# Altium project RPiZeroShield.PrjPcb
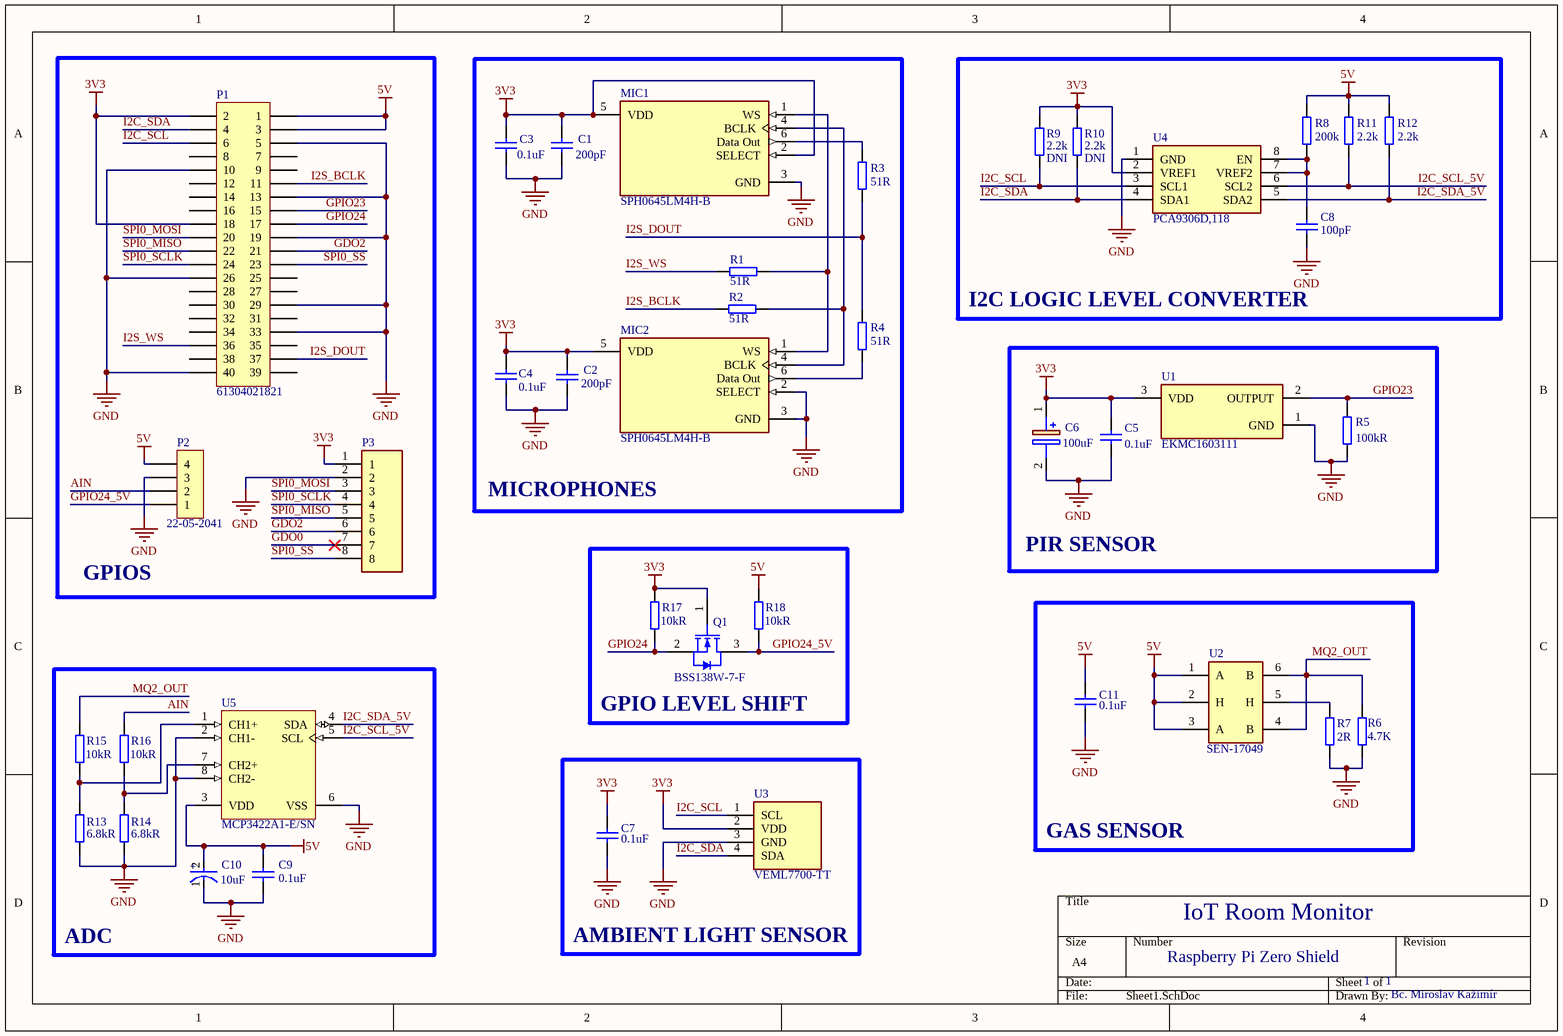
[diagram p0: Sheet1.SchDoc]
1 sheet, 40 parts. Net scope: global (net labels, ports and power ports of the same name join across sheets).
Board file: PCB1.PcbDoc

## Sheet Sheet1.SchDoc: IoT Room Monitor
size A4; DrawnBy: Bc. Miroslav Kažimír; DocumentNumber: Raspberry Pi Zero Shield; SheetNumber: 1; SheetTotal: 1

### Parts
C1  Capacitance: 200pF  [FP-C1206C-EB-MFG]  (hidden comment: C1206C201F4HACTU)
C2  Capacitance: 200pF  [FP-C1206C-EB-MFG]  (hidden comment: C1206C201F4HACTU)
C3  Capacitance: 0.1uF  [FP-GRM319-0_15-IPC_A]  (hidden comment: GRM3195C1H104GA05D)
C4  Capacitance: 0.1uF  [FP-GRM319-0_15-IPC_A]  (hidden comment: GRM3195C1H104GA05D)
C5  Capacitance: 0.1uF  [FP-GRM319-0_15-IPC_A]  (hidden comment: GRM3195C1H104GA05D)
C6  Capacitance: 100uF  [CAPPRD250W50D630H600]  (hidden comment: ECE-A0JKS101B)
C7  Capacitance: 0.1uF  [FP-GRM319-0_15-IPC_A]  (hidden comment: GRM3195C1H104GA05D)
C8  Capacitance: 100pF  [FP-C0805C-DN-IPC_A]  (hidden comment: C0805C101F3HACTU)
C9  Capacitance: 0.1uF  [FP-GRM319-0_15-IPC_A]  (hidden comment: GRM3195C1H104GA05D)
C10  Capacitance: 10uF  [FP-T491A106K020AT-MFG]  (hidden comment: T491A106K020AT)
C11  Capacitance: 0.1uF  [FP-GRM319-0_15-IPC_A]  (hidden comment: GRM3195C1H104GA05D)
MIC1  SPH0645LM4H-B  [FP-SPH0645LM4H-B-MFG]
MIC2  SPH0645LM4H-B  [FP-SPH0645LM4H-B-MFG]
P1  61304021821  [61304021821]
P2  22-05-2041  [22052041]
P3  M22-2010805  [HDRV8W60P0X200_1X8_1600X200X525P]  (value not drawn)
Q1  BSS138W-7-F  [DIOD-SOT323-3_V]
R1  Resistance: 51R  [RESC2013X70X40LL20T20]  (hidden comment: ERJ-6ENF51R0V)
R2  Resistance: 51R  [RESC2013X70X40LL20T20]  (hidden comment: ERJ-6ENF51R0V)
R3  Resistance: 51R  [RESC2013X70X40LL20T20]  (hidden comment: ERJ-6ENF51R0V)
R4  Resistance: 51R  [RESC2013X70X40LL20T20]  (hidden comment: ERJ-6ENF51R0V)
R5  Resistance: 100kR  [RESC3116X65X40LL10T20]  (hidden comment: RC1206FR-07100KL)
R6  Resistance: 4.7K  [RCC1206_e3]  (hidden comment: RCC12064K70FKEA)
R7  Resistance: 2R  [RESC3116X65N]  (hidden comment: RC1206JR-7W2RL)
R8  Resistance: 200k  [RCC1206_e3]  (hidden comment: RCC1206200KFKEA)
R9  Resistance: 2.2k  [RCC1206_e3]  (hidden comment: RCC12062K20FKEA)
R10  Resistance: 2.2k  [RCC1206_e3]  (hidden comment: RCC12062K20FKEA)
R11  Resistance: 2.2k  [RCC1206_e3]  (hidden comment: RCC12062K20FKEA)
R12  Resistance: 2.2k  [RCC1206_e3]  (hidden comment: RCC12062K20FKEA)
R13  Resistance: 6.8kR  [ERJP06_(0805)]  (hidden comment: ERJ-P06D6801V)
R14  Resistance: 6.8kR  [ERJP06_(0805)]  (hidden comment: ERJ-P06D6801V)
R15  Resistance: 10kR  [ERJP08_(1206)]  (hidden comment: ERJ-P08D1002V)
R16  Resistance: 10kR  [ERJP08_(1206)]  (hidden comment: ERJ-P08D1002V)
R17  Resistance: 10kR  [ERJP08_(1206)]  (hidden comment: ERJ-P08D1002V)
R18  Resistance: 10kR  [ERJP08_(1206)]  (hidden comment: ERJ-P08D1002V)
U1  EKMC1603111  [FP-EKMC1603111-MFG]
U2  SEN-17049  [SEN17049]
U3  VEML7700-TT  [VEML7700]
U4  PCA9306D,118  [SOIC127P600X175-8N]
U5  MCP3422A1-E/SN  [SOIC-SN8_N]

### Blocks framed on the sheet
GPIOS: P1-P3
MICROPHONES: C1-C4 MIC1 MIC2 R1-R4
I2C LOGIC LEVEL CONVERTER: C8 R8-R12 U4
PIR SENSOR: C5 C6 R5 U1
GPIO LEVEL SHIFT: Q1 R17 R18
GAS SENSOR: C11 R6 R7 U2
ADC: C9 C10 R13-R16 U5
AMBIENT LIGHT SENSOR: C7 U3

### Nets
3V3: C1.1 C2.1 C3.2 C4.2 C5.2 C6.1(+) C7.1 MIC1.2(SELECT) MIC1.5(VDD) MIC2.5(VDD) P1.2 P1.18 P3.1 Q1.1(G) R9.1 R10.1 R17.1 U1.3(VDD) U3.2(VDD) U4.2(VREF1)
5V: C9.1 C10.2(A) C11.1 P1.1 P1.3 P2.4 R8.2 R11.1 R12.1 R18.1 U2.1(A) U2.2(H) U2.3(A) U5.3(VDD)
GND: C1.2 C2.2 C3.1 C4.1 C5.1 C6.2(-) C7.2 C8.2 C9.2 C10.1(C) C11.2 MIC1.3(GND) MIC2.2(SELECT) MIC2.3(GND) P1.5 P1.10 P1.13 P1.19 P1.26 P1.29 P1.33 P1.40 P2.3 P3.2 R5.2 R6.1 R7.2 R13.2 R14.2 U1.1(GND) U3.3(GND) U4.1(GND) U5.2(CH1-) U5.6(VSS) U5.8(CH2-)
AIN: P2.2 R16.1
GDO0: P3.7
GDO2: P1.21 P3.6
GPIO23: P1.15 R5.1 U1.2(OUTPUT)
GPIO24: P1.17 Q1.2(S) R17.2
GPIO24_5V: P2.1 Q1.3(D) R18.2
I2C_SCL: P1.6 R9.2 U3.1(SCL) U4.3(SCL1)
I2C_SCL_5V: R11.2 U4.6(SCL2) U5.5(SCL)
I2C_SDA: P1.4 R10.2 U3.4(SDA) U4.4(SDA1)
I2C_SDA_5V: R12.2 U4.5(SDA2) U5.4(SDA)
I2S_BCLK: P1.11 R2.1
I2S_DOUT: P1.37 R3.2 R4.2
I2S_WS: P1.36 R1.1
MQ2_OUT: R6.2 R15.1 U2.4(B) U2.6(B)
SPI0_MISO: P1.22 P3.5
SPI0_MOSI: P1.20 P3.3
SPI0_SCLK: P1.24 P3.4
SPI0_SS: P1.23 P3.8
NetC8_1: C8.1 R8.1 U4.7(VREF2) U4.8(EN)
NetMIC1_1: MIC1.1(WS) MIC2.1(WS) R1.2
NetMIC1_4: MIC1.4(BCLK) MIC2.4(BCLK) R2.2
NetMIC1_6: MIC1.6(Data_Out) R3.1
NetMIC2_6: MIC2.6(Data_Out) R4.1
NetR7_1: R7.1 U2.5(H)
NetR13_1: R13.1 R15.2 U5.1(CH1+)
NetR14_1: R14.1 R16.2 U5.7(CH2+)

Not connected (* = marked no-connect by the designer): P1 7 8 9 12 14 16 25 27 28 30 31 32 34 35 38 39

### Notes on the sheet
- DNI
- (near R10) DNI
- (in symbol T491A106K020AT) +

### Library data of the parts
C1 C2 = C1206C201F4HACTU: Manufacturer: KEMET; Supplier 1: Mouser; Manufacturer Part Number: C1206C201F4HACTU; RoHS: Yes; Category: Ceramic Capacitors; Stock 1: 3719; Pricing 1: 1=0,41000, 10=0,27900, 50=0,27900, 100=0,16700, 1000=0,11500, 10000=0,09500 (USD); RoHS Compliant: Yes; Supplier Part Number 1: 80-C1206C201F4HACTU
C3-C5 C7 C9 C11 = GRM3195C1H104GA05D: Multi-Layer Ceramic Capacitor 0.1uF C0G 2% 1206 Paper T/R; Manufacturer: Murata; Supplier 1: Mouser; Manufacturer Part Number: GRM3195C1H104GA05D; RoHS: Yes; Category: Ceramic Capacitors; Stock 1: 17820; Pricing 1: 1=0,69000, 10=0,51100, 50=0,51100, 100=0,35000, 500=0,27800, 1000=0,25100, 2000=0,21300, 10000=0,21300 (USD); RoHS Compliant: Yes; Supplier Part Number 1: 81-GRM3195C1H104GA5D
C6 = ECE-A0JKS101B: Cap Aluminum 100uF 6.3V 20% (6.3 X 5mm) Radial 5mm 71mA 1000 hr 85°C Ammo Pack; Manufacturer: Panasonic; Life (Hours): 1000Hour; Lead Diameter: 0.45mm; Supplier 1: Mouser; Manufacturer Part Number: ECE-A0JKS101B; RoHS: Yes; Category: Aluminum Electrolytic Capacitors; Stock 1: 2081; Pricing 1: 1=0,36000, 10=0,24500, 50=0,16400, 100=0,14000, 1000=0,09900, 10000=0,07500 (USD); Mount: Through Hole; Case/Package: Radial; Contact Plating: Tin; Min Operating Temperature: -40°C; Max Operating Temperature: 85°C; Tolerance: 20%; Ripple Current: 71mA; Termination: Radial; Packaging: Tape and Reel; Package Quantity: 2000; Voltage Rating (DC): 6.3V; Voltage Rating: 6.3V; Series: KS; Construction: RADIAL; Diameter: 6.3mm; Length: 5mm; Height: 5mm; Lead Pitch: 5mm; Height - Seated (Max): 0.236inch; Radiation Hardening: No; RoHS Compliant: Yes; ComponentLink1URL: https://datasheet.ciiva.com/24066/a-e-461514-24066346.pdf?src-supplier=Mouser; ComponentLink1Description: https://datasheet.ciiva.com/24066/a-e-461514-24066346.pdf?src-supplier=Mouser; ComponentLink2URL: https://datasheet.ciiva.com/11680/aba0000ce15-11680725.pdf?src-supplier=Avnet; ComponentLink2Description: https://datasheet.ciiva.com/11680/aba0000ce15-11680725.pdf?src-supplier=Avnet; ComponentLink3URL: https://datasheet.ciiva.com/17536/aba0000ce15-17536026.pdf?src-supplier=Avnet+Europe; ComponentLink3Description: https://datasheet.ciiva.com/17536/aba0000ce15-17536026.pdf?src-supplier=Avnet+Europe; Supplier Part Number 1: 667-ECE-A0JKS101B
C8 = C0805C101F3HACTU: 100.pf 25.0V Rohs Compliant: Yes; Manufacturer: KEMET; Supplier 1: Mouser; Manufacturer Part Number: C0805C101F3HACTU; RoHS: Yes; Category: Ceramic Capacitors; Stock 1: 6773; Pricing 1: 1=0,30000, 10=0,20400, 50=0,20400, 100=0,10400, 1000=0,06200, 10000=0,05400 (USD); RoHS Compliant: Yes; Supplier Part Number 1: 80-C0805C101F3HACTU
C10 = T491A106K020AT: Cap Tant Solid 10uF 20V A CASE 10% (3.2 X 1.6 X 1.6mm) Inward L SMD 3216-18 5 Ohm 125°C T/R; Manufacturer: KEMET; Supplier 1: Mouser; Manufacturer Part Number: T491A106K020AT; RoHS: Yes; Category: Tantalum Capacitors; Stock 1: 134225; Pricing 1: 1=0,70000, 10=0,49300, 50=0,37300, 100=0,32500, 1000=0,31800, 10000=0,19100 (USD); Case/Package: 3216-18; Tolerance: 10%; Length: 3.2mm; Width: 1.6mm; Height: 1.6mm; Lead Free: Lead Free; RoHS Compliant: Yes; ComponentLink1URL: https://4donline.ihs.com/images/VipMasterIC/IC/KEME/KEME-S-A0006487387/KEME-S-A0006487387-1.pdf?hkey=52A5661711E402568146F3353EA87419&src-supplier=Element14; ComponentLink1Description: https://4donline.ihs.com/images/VipMasterIC/IC/KEME/KEME-S-A0006487387/KEME-S-A0006487387-1.pdf?hkey=52A5661711E402568146F3353EA87419&src-supplier=Element14; ComponentLink2URL: https://4donline.ihs.com/images/VipMasterIC/IC/KEME/KEME-S-A0006487387/KEME-S-A0006487387-1.pdf?hkey=52A5661711E402568146F3353EA87419&src-supplier=Farnell; ComponentLink2Description: https://4donline.ihs.com/images/VipMasterIC/IC/KEME/KEME-S-A0006487387/KEME-S-A0006487387-1.pdf?hkey=52A5661711E402568146F3353EA87419&src-supplier=Farnell; ComponentLink3URL: https://4donline.ihs.com/images/VipMasterIC/IC/KEME/KEME-S-A0006487387/KEME-S-A0006487387-1.pdf?hkey=52A5661711E402568146F3353EA87419&src-supplier=Newark; ComponentLink3Description: https://4donline.ihs.com/images/VipMasterIC/IC/KEME/KEME-S-A0006487387/KEME-S-A0006487387-1.pdf?hkey=52A5661711E402568146F3353EA87419&src-supplier=Newark; ComponentLink4URL: https://api.kemet.com/component-edge/download/datasheet/T491A106K020AT.pdf?src-supplier=Digi-Key; ComponentLink4Description: https://api.kemet.com/component-edge/download/datasheet/T491A106K020AT.pdf?src-supplier=Digi-Key; Supplier Part Number 1: 80-T491A106K020AT
MIC1 MIC2 = SPH0645LM4H-B: Crawford Mic Dgt I2S Bottom Port; Manufacturer: Knowles; Shape: Rectangular; Direction: Omnidirectional; Voltage Rating: 1.8V; Operating Supply Current: 600uA; Output Type: Digital; Supplier 1: Mouser; Manufacturer Part Number: SPH0645LM4H-B; RoHS: Yes; Category: Microphones; Stock 1: 19165; Pricing 1: 1=2,91000, 10=2,42000, 25=2,23000, 50=2,10000, 100=1,97000, 500=1,71000, 1000=1,67000, 10000=1,67000 (USD); Packaging: Tape and Reel; Termination: Solder; Length: 3.5mm; Width: 2.65mm; Height: 1.08mm; RoHS Compliant: Yes; ComponentLink1URL: https://media.digikey.com/pdf/Data%20Sheets/Knowles%20Acoustics%20PDFs/SPH0645LM4H-B.pdf?src-supplier=Digi-Key; ComponentLink1Description: https://media.digikey.com/pdf/Data%20Sheets/Knowles%20Acoustics%20PDFs/SPH0645LM4H-B.pdf?src-supplier=Digi-Key; Supplier Part Number 1: 721-SPH0645LM4H-B
P1 = 61304021821: THT Vertical Socket Header WR-PHD, Pitch 2.54 mm, Dual Row, 40 pins; Manufacturer: Wurth Electronics; Gender: Female; Supplier 1: Mouser; Manufacturer Part Number: 61304021821; RoHS: Yes; Stock 1: 6022; Pricing 1: 1=1,92000, 10=1,76000, 50=1,57000, 100=1,37000, 1000=1,27000, 10000=1,27000 (USD); Contact Material: Copper Alloy; RoHS Compliant: Yes; Supplier Part Number 1: 710-61304021821
P2 = 22-05-2041: Connector Unshrouded Header 4 Position 2.54mm Solder Right Angle Thru-Hole Bulk; Manufacturer: Molex; Supplier 1: Mouser; Manufacturer Part Number: 22-05-2041; RoHS: Yes; Category: Headers and Wire Housings; Stock 1: 215; Pricing 1: 1=0,31000, 10=0,27800, 50=0,27800, 100=0,20300, 1000=0,18600, 10000=0,15600 (USD); ComponentLink1URL: https://datasheet.ciiva.com/3934/344080022052041-pcb-headers-3934066.pdf?src-supplier=Arrow+Electronics; ComponentLink1Description: https://datasheet.ciiva.com/3934/344080022052041-pcb-headers-3934066.pdf?src-supplier=Arrow+Electronics; ComponentLink2URL: https://datasheet.ciiva.com/1479/022052031-sd-1479057.pdf?src-supplier=Newark; ComponentLink2Description: https://datasheet.ciiva.com/1479/022052031-sd-1479057.pdf?src-supplier=Newark; ComponentLink3URL: https://datasheet.ciiva.com/11747/0900766b80027334-11747944.pdf?src-supplier=RSComponents; ComponentLink3Description: https://datasheet.ciiva.com/11747/0900766b80027334-11747944.pdf?src-supplier=RSComponents; ComponentLink4URL: https://datasheet.ciiva.com/30116/37900022052041-pcb-headers-30116714.pdf?src-supplier=Onlinecomponents.com; ComponentLink4Description: https://datasheet.ciiva.com/30116/37900022052041-pcb-headers-30116714.pdf?src-supplier=Onlinecomponents.com; ComponentLink5URL: https://datasheet.ciiva.com/19462/878673-19462259.pdf?src-supplier=Jameco; ComponentLink5Description: https://datasheet.ciiva.com/19462/878673-19462259.pdf?src-supplier=Jameco; ComponentLink6URL: https://datasheet.ciiva.com/5155/0022052041-pcb-headers-158320-5155332.pdf?src-supplier=Mouser; ComponentLink6Description: https://datasheet.ciiva.com/5155/0022052041-pcb-headers-158320-5155332.pdf?src-supplier=Mouser; ComponentLink7URL: https://datasheet.ciiva.com/7843/7386-7843894.pdf?src-supplier=Element14; ComponentLink7Description: https://datasheet.ciiva.com/7843/7386-7843894.pdf?src-supplier=Element14; ComponentLink8URL: https://datasheet.ciiva.com/1433/1848135-1433606.pdf?src-supplier=Element14; ComponentLink8Description: https://datasheet.ciiva.com/1433/1848135-1433606.pdf?src-supplier=Element14; ComponentLink9URL: https://datasheet.ciiva.com/10088/0022052041-pcb-headers-10088858.pdf?src-supplier=Avnet; ComponentLink9Description: https://datasheet.ciiva.com/10088/0022052041-pcb-headers-10088858.pdf?src-supplier=Avnet; Supplier Part Number 1: 538-22-05-2041
P3 = M22-2010805: Connector, Header, 8Pos, 1Row, 2Mm Rohs Compliant: Yes; Manufacturer: Harwin; Number of Contacts: 8; Max Current Rating: 1A; Contact Resistance: 20mR; Voltage Rating: 650V; Insulation Resistance: 10GR; Connector Type: Male Pin; Supplier 1: Mouser; Manufacturer Part Number: M22-2010805; RoHS: Yes; Category: Headers and Wire Housings; Stock 1: 686; Pricing 1: 1=0,57000, 10=0,44500, 50=0,44500, 100=0,38500, 1000=0,28800, 10000=0,23600 (USD); Mount: Through Hole; Case/Package: SIL; Contact Plating: Gold; Contact Material: Bronze; Color: Black; Housing Color: Black; Housing Material: Nylon; Min Operating Temperature: -55°C; Max Operating Temperature: 105°C; Number of Rows: 1; Termination: Solder; Current Rating: 1A; Package Quantity: 1000; Packaging: Bulk; Number of Positions: 8; Orientation: Straight; Series: M22; Contact Type: Male Pin; Length: 16mm; Pitch: 2mm; Contact Mating Length: 0.138inch; Depth: 2mm; Radiation Hardening: No; REACH SVHC: No SVHC; Flammability Rating: UL94 V-0; RoHS Compliant: Yes; ComponentLink1URL: https://datasheet.ciiva.com/11751/0900766b800345c0-11751285.pdf?src-supplier=RSComponents; ComponentLink1Description: https://datasheet.ciiva.com/11751/0900766b800345c0-11751285.pdf?src-supplier=RSComponents; ComponentLink2URL: https://datasheet.ciiva.com/9479/m22-201-9479493.pdf?src-supplier=Avnet; ComponentLink2Description: https://datasheet.ciiva.com/9479/m22-201-9479493.pdf?src-supplier=Avnet; ComponentLink3URL: https://datasheet.ciiva.com/6814/m22-201-6814953.pdf?src-supplier=Digi-Key; ComponentLink3Description: https://datasheet.ciiva.com/6814/m22-201-6814953.pdf?src-supplier=Digi-Key; Supplier Part Number 1: 855-M22-2010805
Q1 = BSS138W-7-F: N沟道 VDS=50V VGS=±20V ID=200mA P=200mW; Manufacturer: Diodes; Continuous Drain Current (ID): 200mA; Nominal Vgs: 1.2V; Max Power Dissipation: 200mW; Drain to Source Voltage (Vdss): 50V; Gate to Source Voltage (Vgs): 20V; Rds On Max: 3.5R; Input Capacitance: 50pF; Number of Elements: 1; Drain to Source Breakdown Voltage: 75V; Drain to Source Resistance: 1.4R; Turn-Off Delay Time: 20ns; Element Configuration: Single; Polarity: N-CHANNEL; Supplier 1: Mouser; Manufacturer Part Number: BSS138W-7-F; RoHS: Yes; Category: MOSFETs; Stock 1: 140567; Pricing 1: 1=0,32000, 10=0,26800, 50=0,26800, 100=0,14300, 500=0,09400, 1000=0,06400, 3000=0,04900, 9000=0,04200, 10000=0,04200, 24000=0,03900, 45000=0,03500 (USD); Mount: Surface Mount; Case/Package: SOT-323; Number of Pins: 3; Weight: 0.000212oz; Contact Plating: Tin,Matte; Min Operating Temperature: -55°C; Max Operating Temperature: 150°C; Threshold Voltage: 1.2V; Packaging: Tape and Reel; Package Quantity: 3000; Dual Supply Voltage: 50V; Power Dissipation: 200mW; Turn-On Delay Time: 20ns; Termination: SMD/SMT; Number of Channels: 1; Voltage Rating (DC): 50V; Current Rating: 200mA; Voltage: 50V; On-State Resistance: 3.5R; Series: -; Drain-source On Resistance-Max: 3.5R; Length: 2.2mm; Width: 1.35mm; Height: 1mm; REACH SVHC: No SVHC; Lead Free: Lead Free; RoHS Compliant: Yes; ComponentLink1URL: https://datasheet.ciiva.com/19479/1589937-19479882.pdf?src-supplier=Jameco; ComponentLink1Description: https://datasheet.ciiva.com/19479/1589937-19479882.pdf?src-supplier=Jameco; ComponentLink2URL: https://datasheet.ciiva.com/4442/ds30206-79208-4442805.pdf?src-supplier=Mouser; ComponentLink2Description: https://datasheet.ciiva.com/4442/ds30206-79208-4442805.pdf?src-supplier=Mouser; ComponentLink3URL: https://datasheet.ciiva.com/8115/ds30206-8115376.pdf?src-supplier=Avnet; ComponentLink3Description: https://datasheet.ciiva.com/8115/ds30206-8115376.pdf?src-supplier=Avnet; ComponentLink4URL: https://datasheet.ciiva.com/17099/bss138w-7-f-17099411.pdf?src-supplier=Allied+Electronics; ComponentLink4Description: https://datasheet.ciiva.com/17099/bss138w-7-f-17099411.pdf?src-supplier=Allied+Electronics; ComponentLink5URL: https://datasheet.ciiva.com/1190/ds30206-1190191.pdf?src-supplier=Element14; ComponentLink5Description: https://datasheet.ciiva.com/1190/ds30206-1190191.pdf?src-supplier=Element14; ComponentLink6URL: https://datasheet.ciiva.com/8115/ds30206-8115303.pdf?src-supplier=Avnet; ComponentLink6Description: https://datasheet.ciiva.com/8115/ds30206-8115303.pdf?src-supplier=Avnet; ComponentLink7URL: https://datasheet.ciiva.com/941/ds30206-941177.pdf?src-supplier=Digi-Key; ComponentLink7Description: https://datasheet.ciiva.com/941/ds30206-941177.pdf?src-supplier=Digi-Key; ComponentLink8URL: https://datasheet.ciiva.com/6383/ds30206-6383772.pdf?src-supplier=Digi-Key; ComponentLink8Description: https://datasheet.ciiva.com/6383/ds30206-6383772.pdf?src-supplier=Digi-Key; Supplier Part Number 1: 621-BSS138W-F
R1-R4 = ERJ-6ENF51R0V: 贴片电阻 51Ω ±1% 1/8W ±100ppm/℃ 0805; Manufacturer: Panasonic; Temperature Coefficient: 100ppm/°C; Voltage Rating: 150V; Power Rating: 125mW; Supplier 1: Mouser; Manufacturer Part Number: ERJ-6ENF51R0V; RoHS: Yes; Category: Chip SMD Resistors; Stock 1: 33426; Pricing 1: 1=0,11000, 10=0,08300, 50=0,08300, 100=0,03200, 1000=0,01400, 2500=0,01300, 5000=0,01000, 10000=0,01000 (USD); Mount: Surface Mount; Case/Package: 0805; Contact Plating: Tin; Case Code (Metric): 2012; Case Code (Imperial): 0805; Min Operating Temperature: -55°C; Max Operating Temperature: 155°C; Tolerance: 1%; Resistor Type: Thick Film; Packaging: Tape and Reel; Package Quantity: 1; Number of Terminations: 2; Termination: SMD/SMT; Max Power Dissipation: 125mW; Voltage Rating (DC): 150V; Features: Automotive AEC-Q200; Series: ERJ; Technology: THICK FILM; Construction: Rectangular; Resistance Tolerance: 1%; Length: 2mm; Width: 0.049inch; Height: 0.6mm; Depth: 1.25mm; Radiation Hardening: No; REACH SVHC: No SVHC; Military Standard: Not; RoHS Compliant: Yes; ComponentLink1URL: https://datasheet.ciiva.com/11821/0900766b80f80784-11821666.pdf?src-supplier=RSComponents; ComponentLink1Description: https://datasheet.ciiva.com/11821/0900766b80f80784-11821666.pdf?src-supplier=RSComponents; ComponentLink2URL: https://datasheet.ciiva.com/46444/1678782-46444822.pdf?src-supplier=Element14; ComponentLink2Description: https://datasheet.ciiva.com/46444/1678782-46444822.pdf?src-supplier=Element14; ComponentLink3URL: https://datasheet.ciiva.com/24069/aoa0000ce2-24069916.pdf?src-supplier=Mouser; ComponentLink3Description: https://datasheet.ciiva.com/24069/aoa0000ce2-24069916.pdf?src-supplier=Mouser; ComponentLink4URL: https://datasheet.ciiva.com/16787/70260748-16787022.pdf?src-supplier=Allied+Electronics; ComponentLink4Description: https://datasheet.ciiva.com/16787/70260748-16787022.pdf?src-supplier=Allied+Electronics; ComponentLink5URL: https://datasheet.ciiva.com/16786/70260748-16786149.pdf?src-supplier=Allied+Electronics; ComponentLink5Description: https://datasheet.ciiva.com/16786/70260748-16786149.pdf?src-supplier=Allied+Electronics; ComponentLink6URL: https://datasheet.ciiva.com/9189/aoa0000ce2-9189048.pdf?src-supplier=Avnet; ComponentLink6Description: https://datasheet.ciiva.com/9189/aoa0000ce2-9189048.pdf?src-supplier=Avnet; ComponentLink7URL: https://datasheet.ciiva.com/30237/aoa0000ce2-30237990.pdf?src-supplier=Onlinecomponents.com; ComponentLink7Description: https://datasheet.ciiva.com/30237/aoa0000ce2-30237990.pdf?src-supplier=Onlinecomponents.com; ComponentLink8URL: https://datasheet.ciiva.com/17209/aoa0000ce2-17209369.pdf?src-supplier=Avnet+Europe; ComponentLink8Description: https://datasheet.ciiva.com/17209/aoa0000ce2-17209369.pdf?src-supplier=Avnet+Europe; Supplier Part Number 1: 667-ERJ-6ENF51R0V
R5 = RC1206FR-07100KL: 贴片电阻 100000Ω ± 1.00% 0.25W ± 100ppm/℃ 1206; Manufacturer: Yageo; Tolerance: 1%; Temperature Coefficient: 100ppm/°C; Power Rating: 250mW; Voltage Rating: 200V; Supplier 1: Mouser; Manufacturer Part Number: RC1206FR-07100KL; RoHS: Yes; Category: Chip SMD Resistors; Stock 1: 216861; Pricing 1: 1=0,10000, 10=0,05200, 50=0,05200, 100=0,02200, 1000=0,01000, 10000=0,00500 (USD); Case/Package: 1206; Case Code (Imperial): 1206; Case Code (Metric): 3216; Size Code: 1206; Min Operating Temperature: -55°C; Max Operating Temperature: 155°C; Packaging: Tape and Reel; Resistor Type: Thick Film; Termination: SMD/SMT; Features: Moisture Resistant; Series: RC; Max Power Dissipation: 250mW; Number of Terminations: 2; Resistance Tolerance: 1%; Length: 3.1mm; Height: 0.55mm; Depth: 1.6mm; REACH SVHC: No SVHC; Lead Free: Lead Free; RoHS Compliant: Yes; Supplier Part Number 1: 603-RC1206FR-07100KL
R6 = RCC12064K70FKEA: Res, 4K7, 1%, 0.5W, 1206, Thick Film;; Manufacturer: Vishay; Supplier 1: Mouser; Manufacturer Part Number: RCC12064K70FKEA; RoHS: Yes; Category: Chip SMD Resistors; Stock 1: 24548; Pricing 1: 1=0,32000, 10=0,27600, 50=0,27600, 100=0,10800, 250=0,10700, 1000=0,04500, 5000=0,04300, 10000=0,04300 (USD); Supplier Part Number 1: 71-RCC12064K70FKEA
R7 = RC1206JR-7W2RL: Res Thick Film 1206 2 Ohm 5% 0.5W(1/2W) ±200ppm/C Pad SMD T/R; Manufacturer: Yageo; Supplier 1: Mouser; Manufacturer Part Number: RC1206JR-7W2RL; RoHS: Yes; Category: Resistors; Stock 1: 5881; Pricing 1: 1=0,19000, 10=0,15900, 50=0,15900, 100=0,06300, 1000=0,03100, 10000=0,02000 (USD); Case/Package: 1206; Tolerance: 5%; RoHS Compliant: Yes; Supplier Part Number 1: 603-RC1206JR-7W2RL
R8 = RCC1206200KFKEA: Res, AEC-Q200, 200K, 1%, 0.5W, 1206 Rohs Compliant: Yes; Manufacturer: Vishay; Supplier 1: Mouser; Manufacturer Part Number: RCC1206200KFKEA; RoHS: Yes; Category: Chip SMD Resistors; Stock 1: 7464; Pricing 1: 1=0,32000, 10=0,27600, 50=0,27600, 100=0,10800, 250=0,10700, 1000=0,04500, 5000=0,04300, 10000=0,04300 (USD); Supplier Part Number 1: 71-RCC1206200KFKEA
R9-R12 = RCC12062K20FKEA: Res, Aec-Q200, 2K2, 1%, 0.5W, 1206 Rohs Compliant: Yes; Manufacturer: Vishay; Supplier 1: Mouser; Manufacturer Part Number: RCC12062K20FKEA; RoHS: No; Category: Chip SMD Resistors; Stock 1: 10157; Pricing 1: 1=0,32000, 10=0,27600, 50=0,27600, 100=0,10800, 250=0,10700, 1000=0,04500, 5000=0,04300, 10000=0,04300 (USD); Supplier Part Number 1: 71-RCC12062K20FKEA
R13 R14 = ERJ-P06D6801V: Res Thick Film 0805 6.8K Ohm 0.5% 0.25W ±100ppm/°C Molded SMD Punched Carrier T/R; Manufacturer: Panasonic; Power Rating: 500mW; Voltage Rating: 400V; Supplier 1: Mouser; Manufacturer Part Number: ERJ-P06D6801V; RoHS: Yes; Category: Chip SMD Resistors; Stock 1: 8417; Pricing 1: 1=0,31000, 10=0,27300, 50=0,27300, 100=0,10700, 1000=0,04500, 10000=0,03500 (USD); Mount: Surface Mount; Case/Package: 0805; Weight: 0.000194oz; Case Code (Imperial): 0805; Case Code (Metric): 2012; Min Operating Temperature: -55°C; Max Operating Temperature: 155°C; Tolerance: 0.5%; Packaging: Tape and Reel; Package Quantity: 5000; Resistor Type: Thick Film; Termination: SMD/SMT; Temperature Coefficient: 100ppm/°C; Length: 2mm; Width: 1.2mm; Height: 0.6mm; ComponentLink1URL: https://datasheet.ciiva.com/24180/aoa0000ce4-64075-24180870.pdf?src-supplier=Mouser; ComponentLink1Description: https://datasheet.ciiva.com/24180/aoa0000ce4-64075-24180870.pdf?src-supplier=Mouser; Supplier Part Number 1: 667-ERJ-P06D6801V
R15-R18 = ERJ-P08D1002V: Res Thick Film 1206 10K Ohm 0.5% 0.33W ±100ppm/°C Molded SMD Punched Carrier T/R; Manufacturer: Panasonic; Power Rating: 660mW; Voltage Rating: 500V; Supplier 1: Mouser; Manufacturer Part Number: ERJ-P08D1002V; RoHS: Yes; Category: Chip SMD Resistors; Stock 1: 4279; Pricing 1: 1=0,36000, 10=0,31400, 50=0,31400, 100=0,12600, 1000=0,06000, 10000=0,04000 (USD); Mount: Surface Mount; Case/Package: 1206; Case Code (Imperial): 1206; Case Code (Metric): 3216; Min Operating Temperature: -55°C; Max Operating Temperature: 155°C; Package Quantity: 5000; Packaging: Tape and Reel; Tolerance: 0.5%; Resistor Type: Thick Film; Temperature Coefficient: 100ppm/°C; Length: 3.2mm; Width: 1.6mm; Height: 0.6mm; ComponentLink1URL: http://www.mouser.com/ds/2/315/AOA0000C291-1101061.pdf?src-supplier=Mouser; ComponentLink1Description: http://www.mouser.com/ds/2/315/AOA0000C291-1101061.pdf?src-supplier=Mouser; ComponentLink2URL: http://www.onlinecomponents.com/datasheet/erj-p08d1002v.aspx?p=44449323&src-supplier=Onlinecomponents.com; ComponentLink2Description: http://www.onlinecomponents.com/datasheet/erj-p08d1002v.aspx?p=44449323&src-supplier=Onlinecomponents.com; Supplier Part Number 1: 667-ERJ-P08D1002V
U1 = EKMC1603111: PaPIRs MOTION SENSOR VZ series 170uA (White) 12m detection range; Manufacturer: Panasonic; Max Supply Voltage: 6V; Min Supply Voltage: 3V; Sensing Distance: 472inch; Output Type: Digital; Sensing Method: Infrared (IR); Output Voltage: 500mV; Supplier 1: Mouser; Manufacturer Part Number: EKMC1603111; RoHS: Yes; Category: Motion Sensors; Stock 1: 270; Pricing 1: 1=13,18000, 10=10,76000, 50=9,95000, 100=8,33000, 250=8,06000, 500=7,80000, 1000=7,39000, 2500=7,15000, 5000=6,99000, 10000=7,39000 (USD); Mount: Through Hole; Case/Package: TO-5; Number of Pins: 3; Min Operating Temperature: -20°C; Max Operating Temperature: 60°C; Packaging: Bulk; Package Quantity: 50; Operating Supply Current: 170uA; Min Supply Voltage (DC): 3V; Max Supply Voltage (DC): 6V; Output Current: 170uA; REACH SVHC: No SVHC; Lead Free: Lead Free; RoHS Compliant: Yes; ComponentLink1URL: https://datasheet.ciiva.com/1314/1537854-1314623.pdf?src-supplier=Element14; ComponentLink1Description: https://datasheet.ciiva.com/1314/1537854-1314623.pdf?src-supplier=Element14; ComponentLink2URL: https://datasheet.ciiva.com/1314/1537854-1314441.pdf?src-supplier=Element14; ComponentLink2Description: https://datasheet.ciiva.com/1314/1537854-1314441.pdf?src-supplier=Element14; ComponentLink3URL: https://datasheet.ciiva.com/24392/papirs-ekmc-catalog-24392999.pdf?src-supplier=Onlinecomponents.com; ComponentLink3Description: https://datasheet.ciiva.com/24392/papirs-ekmc-catalog-24392999.pdf?src-supplier=Onlinecomponents.com; Supplier Part Number 1: 769-EKMC1603111
U2 = SEN-17049: Smoke Sensor - MQ-2; Manufacturer: SparkFun; Supplier 1: Mouser; Manufacturer Part Number: SEN-17049; RoHS: No; Stock 1: 63; Pricing 1: 1=4,95000, 10=4,95000, 50=4,95000, 100=4,95000, 1000=4,95000, 10000=4,95000 (USD); Supplier Part Number 1: 474-SEN-17049
U3 = VEML7700-TT: Light to Digital Ambient Light Sensor Digital 0lux to 167000lux 8-Pin SMD T/R; Manufacturer: Vishay Semiconductors; Min Supply Voltage (DC): 2.5V; Max Supply Voltage (DC): 3.6V; Output Current: 3mA; Supplier 1: Mouser; Manufacturer Part Number: VEML7700-TT; RoHS: Yes; Category: Connectors; Stock 1: 23053; Pricing 1: 1=2,13000, 10=1,50000, 50=1,50000, 100=1,16000, 1000=0,86300, 10000=0,86200 (USD); Mount: Surface Mount; Case/Package: SMD/SMT; Packaging: Tape and Reel; REACH SVHC: No SVHC; RoHS Compliant: Yes; ComponentLink1URL: http://www.farnell.com/datasheets/2118175.pdf?_ga=2.74067602.1265931949.1503988629-1413671594.1503025027&src-supplier=Farnell; ComponentLink1Description: http://www.farnell.com/datasheets/2118175.pdf?_ga=2.74067602.1265931949.1503988629-1413671594.1503025027&src-supplier=Farnell; ComponentLink2URL: http://www.farnell.com/datasheets/2118175.pdf?src-supplier=Element14; ComponentLink2Description: http://www.farnell.com/datasheets/2118175.pdf?src-supplier=Element14; ComponentLink3URL: http://www.farnell.com/datasheets/2118175.pdf?_ga=2.74067602.1265931949.1503988629-1413671594.1503025027&src-supplier=Newark; ComponentLink3Description: http://www.farnell.com/datasheets/2118175.pdf?_ga=2.74067602.1265931949.1503988629-1413671594.1503025027&src-supplier=Newark; ComponentLink4URL: http://www.vishay.com/docs/84286/veml7700.pdf?src-supplier=Digi-Key; ComponentLink4Description: http://www.vishay.com/docs/84286/veml7700.pdf?src-supplier=Digi-Key; Supplier Part Number 1: 78-VEML7700-TT
U4 = PCA9306D,118: PCA9306 Series 3.3 V Dual Bidirectional Voltage-Level Translator - SOIC-8; Manufacturer: NXP Semiconductors; Interface: I2C,SMBus; Min Supply Voltage: 1V; Max Supply Voltage: 5V; Number of Channels: 2; Propagation Delay: 3.3ns; Turn-On Delay Time: 1.5ns; Supplier 1: Mouser; Manufacturer Part Number: PCA9306D,118; RoHS: Yes; Category: Interface ICs; Stock 1: 2085; Pricing 1: 1=0,96000, 10=0,84000, 50=0,84000, 100=0,64400, 250=0,59800, 500=0,50900, 1000=0,48000, 2500=0,47900, 10000=0,47900 (USD); Mount: Surface Mount; Case/Package: SO; Number of Pins: 8; Min Operating Temperature: -40°C; Max Operating Temperature: 85°C; Logic Function: Translator; Package Quantity: 2500; Packaging: Tape and Reel; Number of Bits: 2; Output Type: Voltage; Series: -; Radiation Hardening: No; REACH SVHC: No SVHC; Lead Free: Lead Free; RoHS Compliant: Yes; ComponentLink1URL: https://datasheet.ciiva.com/1898/pca9306-1898992.pdf?src-supplier=Digi-Key; ComponentLink1Description: https://datasheet.ciiva.com/1898/pca9306-1898992.pdf?src-supplier=Digi-Key; ComponentLink2URL: https://datasheet.ciiva.com/15095/getdatasheetpartid-468969-15095628.pdf?src-supplier=Verical; ComponentLink2Description: https://datasheet.ciiva.com/15095/getdatasheetpartid-468969-15095628.pdf?src-supplier=Verical; ComponentLink3URL: https://datasheet.ciiva.com/1504/1805226-1504148.pdf?src-supplier=Element14; ComponentLink3Description: https://datasheet.ciiva.com/1504/1805226-1504148.pdf?src-supplier=Element14; ComponentLink4URL: https://datasheet.ciiva.com/16219/pca9306-16219814.pdf?src-supplier=Future+Electronics; ComponentLink4Description: https://datasheet.ciiva.com/16219/pca9306-16219814.pdf?src-supplier=Future+Electronics; ComponentLink5URL: https://datasheet.ciiva.com/1611/1805226-1611291.pdf?src-supplier=Newark; ComponentLink5Description: https://datasheet.ciiva.com/1611/1805226-1611291.pdf?src-supplier=Newark; ComponentLink6URL: https://datasheet.ciiva.com/1898/pca9306-1898990.pdf?src-supplier=Digi-Key; ComponentLink6Description: https://datasheet.ciiva.com/1898/pca9306-1898990.pdf?src-supplier=Digi-Key; ComponentLink7URL: https://datasheet.ciiva.com/1898/pca9306-1898991.pdf?src-supplier=Digi-Key; ComponentLink7Description: https://datasheet.ciiva.com/1898/pca9306-1898991.pdf?src-supplier=Digi-Key; Supplier Part Number 1: 771-PCA9306D-T
U5 = MCP3422A1-E/SN: 2-Channel Single ADC Delta-Sigma 3.75sps 18-bit Serial Automotive 8-Pin SOIC N Tube; Manufacturer: Microchip; Interface: I2C,Serial,2-Wire; Number of Channels: 2; Min Supply Voltage: 2.7V; Max Supply Voltage: 5.5V; Number of Bits: 18; Sampling Rate: 3.75S/s; Number of Converters: 1; Resolution: 18b; Input Type: DIFFERENTIAL; Supplier 1: Mouser; Manufacturer Part Number: MCP3422A1-E/SN; RoHS: Yes; Category: Analog to Digital Converters (ADCs); Stock 1: 494; Pricing 1: 1=3,76000, 10=3,76000, 50=3,14000, 100=2,92000, 1000=2,92000, 10000=2,92000 (USD); Mount: Surface Mount; Case/Package: SOIC; Number of Pins: 8; Min Operating Temperature: -55°C; Max Operating Temperature: 125°C; Packaging: Rail/Tube; Conversion Rate: 3.75S/s; RoHS Compliant: Yes; ComponentLink1URL: https://datasheet.ciiva.com/6659/22088c-6659989.pdf?src-supplier=Digi-Key; ComponentLink1Description: https://datasheet.ciiva.com/6659/22088c-6659989.pdf?src-supplier=Digi-Key; Supplier Part Number 1: 579-MCP3422A1-E/SN